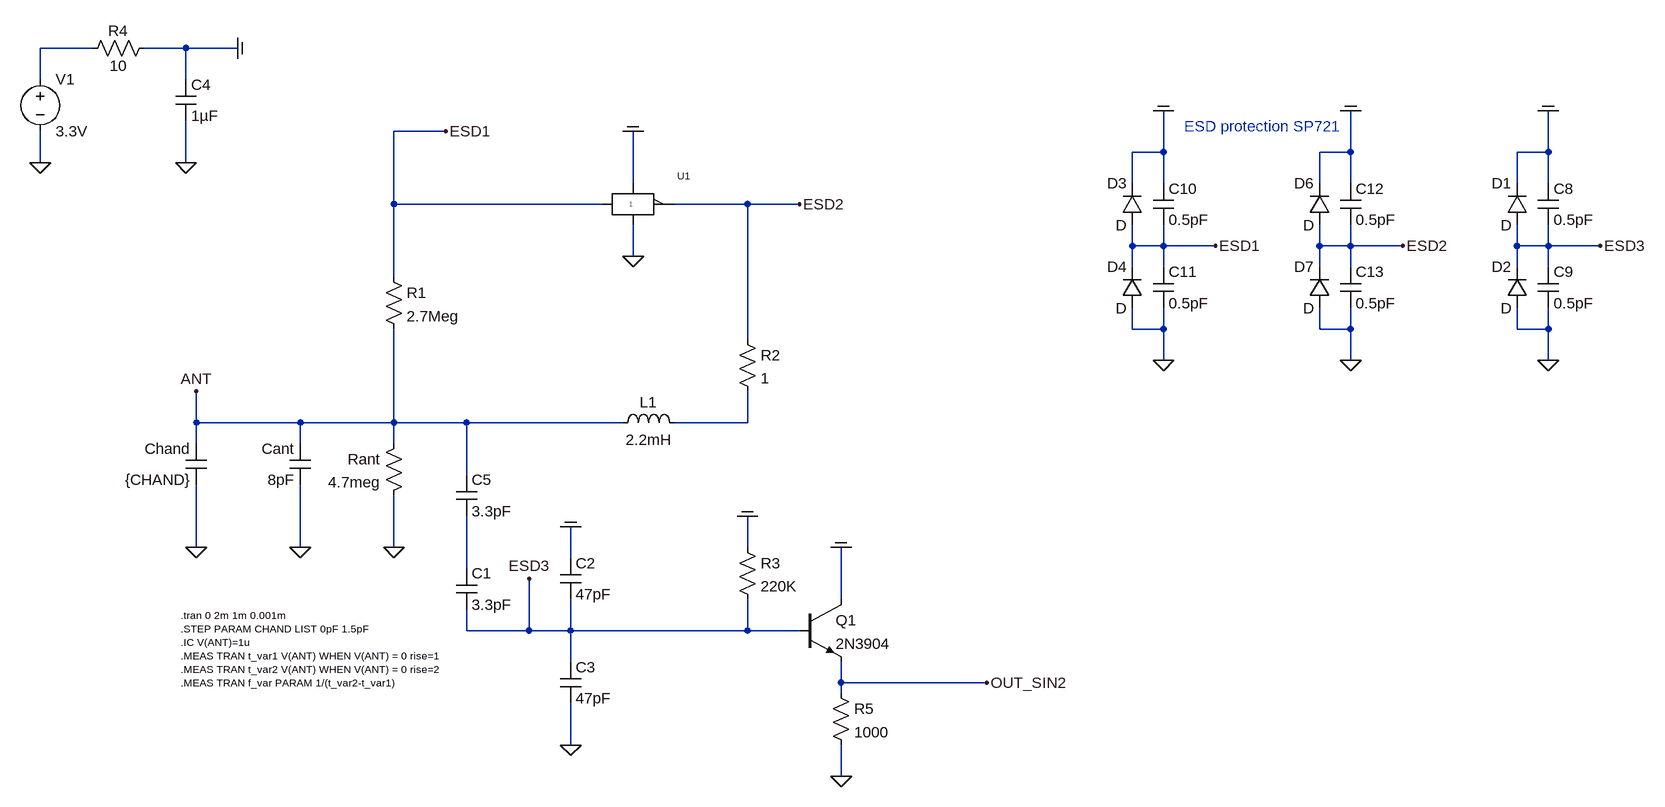
[diagram p0: schematic 2020_analog_oscill_sin_33v_v04.asc]
2020_analog_oscill_sin_33v_v04.asc, the LTspice schematic file:
Version 4
SHEET 1 2908 1508
WIRE -1232 -384 -1312 -384
WIRE -1088 -384 -1152 -384
WIRE -1008 -384 -1088 -384
WIRE -1312 -336 -1312 -384
WIRE -1088 -336 -1088 -384
WIRE -688 -256 -768 -256
WIRE 416 -224 416 -288
WIRE 416 -224 368 -224
WIRE 704 -224 704 -288
WIRE 704 -224 656 -224
WIRE 1008 -224 1008 -288
WIRE 1008 -224 960 -224
WIRE -1312 -208 -1312 -256
WIRE -1088 -208 -1088 -272
WIRE -400 -176 -400 -256
WIRE 368 -176 368 -224
WIRE 416 -176 416 -224
WIRE 656 -176 656 -224
WIRE 704 -176 704 -224
WIRE 960 -176 960 -224
WIRE 1008 -176 1008 -224
WIRE -768 -144 -768 -256
WIRE -448 -144 -768 -144
WIRE -224 -144 -336 -144
WIRE -144 -144 -224 -144
WIRE 368 -80 368 -112
WIRE 416 -80 416 -112
WIRE 416 -80 368 -80
WIRE 496 -80 416 -80
WIRE 656 -80 656 -112
WIRE 704 -80 704 -112
WIRE 704 -80 656 -80
WIRE 784 -80 704 -80
WIRE 960 -80 960 -112
WIRE 1008 -80 1008 -112
WIRE 1008 -80 960 -80
WIRE 1088 -80 1008 -80
WIRE -400 -64 -400 -112
WIRE 368 -48 368 -80
WIRE 416 -48 416 -80
WIRE 656 -48 656 -80
WIRE 704 -48 704 -80
WIRE 960 -48 960 -80
WIRE 1008 -48 1008 -80
WIRE -768 -32 -768 -144
WIRE 368 48 368 16
WIRE 416 48 416 16
WIRE 416 48 368 48
WIRE 656 48 656 16
WIRE 704 48 704 16
WIRE 704 48 656 48
WIRE 960 48 960 16
WIRE 1008 48 1008 16
WIRE 1008 48 960 48
WIRE -224 64 -224 -144
WIRE 416 96 416 48
WIRE 704 96 704 48
WIRE 1008 96 1008 48
WIRE -1072 192 -1072 144
WIRE -912 192 -1072 192
WIRE -768 192 -768 48
WIRE -768 192 -912 192
WIRE -656 192 -768 192
WIRE -416 192 -656 192
WIRE -224 192 -224 144
WIRE -224 192 -336 192
WIRE -1072 224 -1072 192
WIRE -912 224 -912 192
WIRE -768 224 -768 192
WIRE -656 272 -656 192
WIRE -1072 384 -1072 288
WIRE -912 384 -912 288
WIRE -768 384 -768 304
WIRE -224 384 -224 336
WIRE -496 400 -496 352
WIRE -656 416 -656 336
WIRE -80 464 -80 384
WIRE -656 512 -656 480
WIRE -560 512 -560 432
WIRE -560 512 -656 512
WIRE -496 512 -496 464
WIRE -496 512 -560 512
WIRE -224 512 -224 464
WIRE -224 512 -496 512
WIRE -144 512 -224 512
WIRE -496 560 -496 512
WIRE -80 592 -80 560
WIRE 144 592 -80 592
WIRE -80 608 -80 592
WIRE -496 688 -496 624
WIRE -80 736 -80 688
FLAG -1312 -208 0
FLAG -1072 384 0
FLAG -1072 144 ANT
FLAG -768 384 0
FLAG -1008 -384 COM
FLAG 416 96 0
FLAG 416 -288 COM
FLAG 496 -80 ESD1
FLAG 704 96 0
FLAG 704 -288 COM
FLAG 784 -80 ESD2
FLAG 1008 96 0
FLAG 1008 -288 COM
FLAG 1088 -80 ESD3
FLAG -912 384 0
FLAG -400 -256 COM
FLAG -496 688 0
FLAG -688 -256 ESD1
FLAG -144 -144 ESD2
FLAG -560 432 ESD3
FLAG -224 336 COM
FLAG -496 352 COM
FLAG -400 -64 0
FLAG -80 736 0
FLAG -80 384 COM
FLAG 144 592 OUT_SIN2
FLAG -1088 -208 0
SYMBOL voltage -1312 -352 R0
WINDOW 123 0 0 Left 2
WINDOW 39 0 0 Left 2
SYMATTR InstName V1
SYMATTR Value 3.3V
SYMBOL ind -320 208 M270
WINDOW 0 32 56 VTop 2
WINDOW 3 5 56 VBottom 2
SYMATTR InstName L1
SYMATTR Value 2.2mH
SYMATTR SpiceLine Ipk=0.1 Rser=72 Rpar=1.9Meg Cpar=1.147pF
SYMBOL cap -1056 224 M0
SYMATTR InstName Chand
SYMATTR Value {CHAND}
SYMBOL res -752 208 M0
SYMATTR InstName Rant
SYMATTR Value 4.7meg
SYMBOL diode 384 -112 R180
WINDOW 0 24 64 Left 2
WINDOW 3 24 0 Left 2
SYMATTR InstName D3
SYMBOL diode 384 16 R180
WINDOW 0 24 64 Left 2
WINDOW 3 24 0 Left 2
SYMATTR InstName D4
SYMBOL cap 400 -176 R0
SYMATTR InstName C10
SYMATTR Value 0.5pF
SYMBOL cap 400 -48 R0
SYMATTR InstName C11
SYMATTR Value 0.5pF
SYMBOL diode 672 -112 R180
WINDOW 0 24 64 Left 2
WINDOW 3 24 0 Left 2
SYMATTR InstName D6
SYMBOL diode 672 16 R180
WINDOW 0 24 64 Left 2
WINDOW 3 24 0 Left 2
SYMATTR InstName D7
SYMBOL cap 688 -176 R0
SYMATTR InstName C12
SYMATTR Value 0.5pF
SYMBOL cap 688 -48 R0
SYMATTR InstName C13
SYMATTR Value 0.5pF
SYMBOL diode 976 -112 R180
WINDOW 0 24 64 Left 2
WINDOW 3 24 0 Left 2
SYMATTR InstName D1
SYMBOL diode 976 16 R180
WINDOW 0 24 64 Left 2
WINDOW 3 24 0 Left 2
SYMATTR InstName D2
SYMBOL cap 992 -176 R0
SYMATTR InstName C8
SYMATTR Value 0.5pF
SYMBOL cap 992 -48 R0
SYMATTR InstName C9
SYMATTR Value 0.5pF
SYMBOL cap -896 224 M0
SYMATTR InstName Cant
SYMATTR Value 8pF
SYMBOL res -784 -48 R0
SYMATTR InstName R1
SYMATTR Value 2.7Meg
SYMBOL cap -672 416 R0
SYMATTR InstName C1
SYMATTR Value 3.3pF
SYMBOL cap -512 560 R0
SYMATTR InstName C3
SYMATTR Value 47pF
SYMBOL res -240 48 R0
SYMATTR InstName R2
SYMATTR Value 1
SYMBOL res -240 368 R0
SYMATTR InstName R3
SYMATTR Value 220K
SYMBOL cap -512 400 R0
SYMATTR InstName C2
SYMATTR Value 47pF
SYMBOL SBORKA\\Logika\\74AHC1G04 -400 -192 R0
SYMATTR InstName U1
SYMBOL npn -144 464 R0
SYMATTR InstName Q1
SYMATTR Value 2N3904
SYMBOL res -96 592 R0
SYMATTR InstName R5
SYMATTR Value 1000
SYMBOL res -1136 -400 R90
WINDOW 0 5 56 VBottom 2
WINDOW 3 27 56 VTop 2
SYMATTR InstName R4
SYMATTR Value 10
SYMBOL cap -1104 -336 R0
SYMATTR InstName C4
SYMATTR Value 1µF
SYMBOL cap -672 272 R0
SYMATTR InstName C5
SYMATTR Value 3.3pF
TEXT -1096 488 Left 1 !.tran 0 2m 1m 0.001m\n.STEP PARAM CHAND LIST 0pF 1.5pF\n.IC V(ANT)=1u\n.MEAS TRAN t_var1 V(ANT) WHEN V(ANT) = 0 rise=1\n.MEAS TRAN t_var2 V(ANT) WHEN V(ANT) = 0 rise=2\n.MEAS TRAN f_var PARAM 1/(t_var2-t_var1)
TEXT 448 -264 Left 2 ;ESD protection SP721

The netlist it stands for:
* 2020_analog_oscill_sin_33v_v04.asc
V1 N001 0 3.3V
L1 N002 ANT 2.2mH Ipk=0.1 Rser=72 Rpar=1.9Meg Cpar=1.147pF
Chand ANT 0 {CHAND}
Rant ANT 0 4.7meg
D3 ESD1 COM D
D4 0 ESD1 D
C10 COM ESD1 0.5pF
C11 ESD1 0 0.5pF
D6 ESD2 COM D
D7 0 ESD2 D
C12 COM ESD2 0.5pF
C13 ESD2 0 0.5pF
D1 ESD3 COM D
D2 0 ESD3 D
C8 COM ESD3 0.5pF
C9 ESD3 0 0.5pF
Cant ANT 0 8pF
R1 ESD1 ANT 2.7Meg
C1 N003 ESD3 3.3pF
C3 ESD3 0 47pF
R2 ESD2 N002 1
R3 COM ESD3 220K
C2 COM ESD3 47pF
XU1 ESD1 ESD2 COM 0 74AHC1G04  ; pins in out vcc gnd
Q1 COM ESD3 OUT_SIN2 0 2N3904
R5 OUT_SIN2 0 1000
R4 COM N001 10
C4 COM 0 1µF
C5 ANT N003 3.3pF
.model D D
.lib standard.dio
.model NPN NPN
.model PNP PNP
.lib standard.bjt
.tran 0 2m 1m 0.001m
.STEP PARAM CHAND LIST 0pF 1.5pF
.IC V(ANT)=1u
.MEAS TRAN t_var1 V(ANT) WHEN V(ANT) = 0 rise=1
.MEAS TRAN t_var2 V(ANT) WHEN V(ANT) = 0 rise=2
.MEAS TRAN f_var PARAM 1/(t_var2-t_var1)
* ESD protection SP721
.lib 74AHC1G04.cir
.backanno
.end